# EAGLE schematic rxtx (EAGLE 7.3.0)
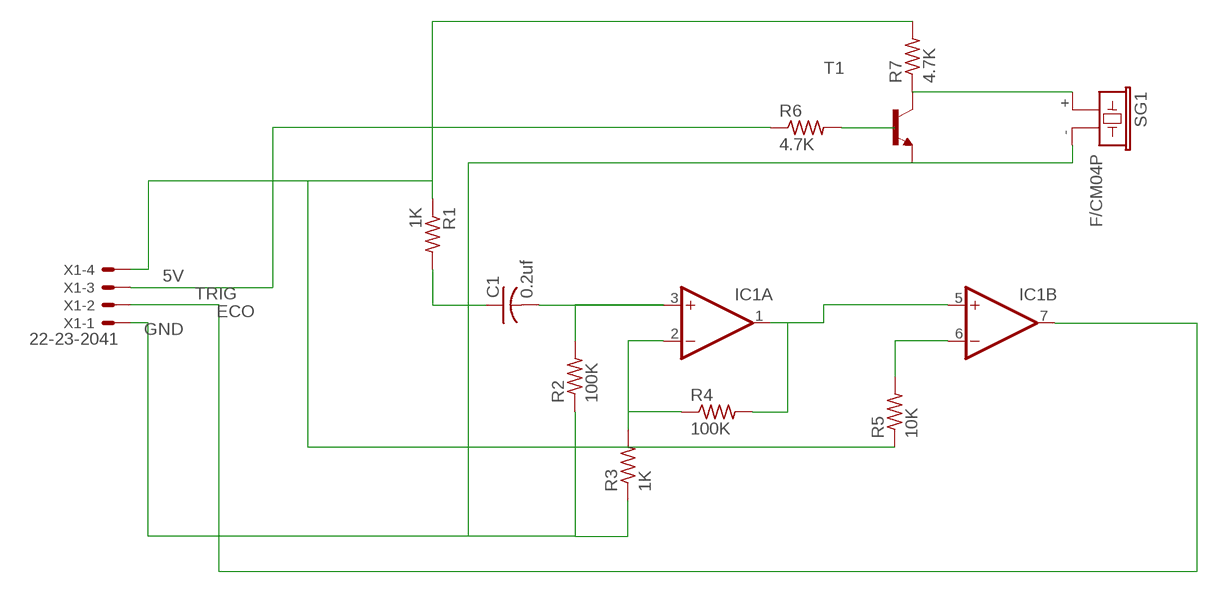
[diagram p0: schematic, sheet 1]

## Parts
C1  0.2uf  C-USC0805  [C0805]
IC1  2AMP_P8+4D  [SO08]
R1  1K  R-US_R0805  [R0805]
R2  100K  R-US_R0805  [R0805]
R3  1K  R-US_R0805  [R0805]
R4  100K  R-US_R0805  [R0805]
R5  10K  R-US_R0805  [R0805]
R6  4.7K  R-US_R0805  [R0805]
R7  4.7K  R-US_R0805  [R0805]
SG1  F/CM04P  [F/CM04P]
T1  -NPN-SOT23-EBC  [SOT23-EBC]
X1  22-23-2041  [22-23-2041]

## Nets
5V: R1.1 R5.1 R7.2 X1.4
ECO: IC1.7(B:OUT) X1.2
GND: R2.1 R3.1 SG1.- T1.E X1.1
N$1: C1.2 IC1.3(A:+IN) R2.2
N$2: C1.1 R1.2
N$3: IC1.2(A:-IN) R3.2 R4.1
N$4: IC1.1(A:OUT) IC1.5(B:+IN) R4.2
N$5: R6.2
N$6: IC1.6(B:-IN) R5.2
N$7: R7.1 SG1.+ T1.C
TRIG: R6.1 X1.3
Unconnected: T1.B

## Power pins joined to a net without a drawn wire
V+: IC1.8(P:V+)
V-: IC1.4(P:V-)

## Library data of the parts
C1 = resistor:C-US: CAPACITOR, American symbol
IC1 = linear:2AMP_P8+4: OP AMP
R1-R7 = resistor:R-US_: RESISTOR, American symbol
SG1 = buzzer:F/CM04P: BUZZER Source: Buerklin; OC_FARNELL: unknown; OC_NEWARK: unknown
T1 = transistor:*-NPN-: NPN Transistror BF959 corrected 2008.03.06
X1 = con-molex:22-23-2041: .100" (2.54mm) Center Header - 4 Pin; MF: MOLEX; MPN: 22-23-2041; OC_FARNELL: 1462920; OC_NEWARK: 38C0355